# Altium schematic sheet Mixer.SchDoc: Ararinha 6F
size A4; Revision: 2.0; SheetNumber: 3; SheetTotal: 7
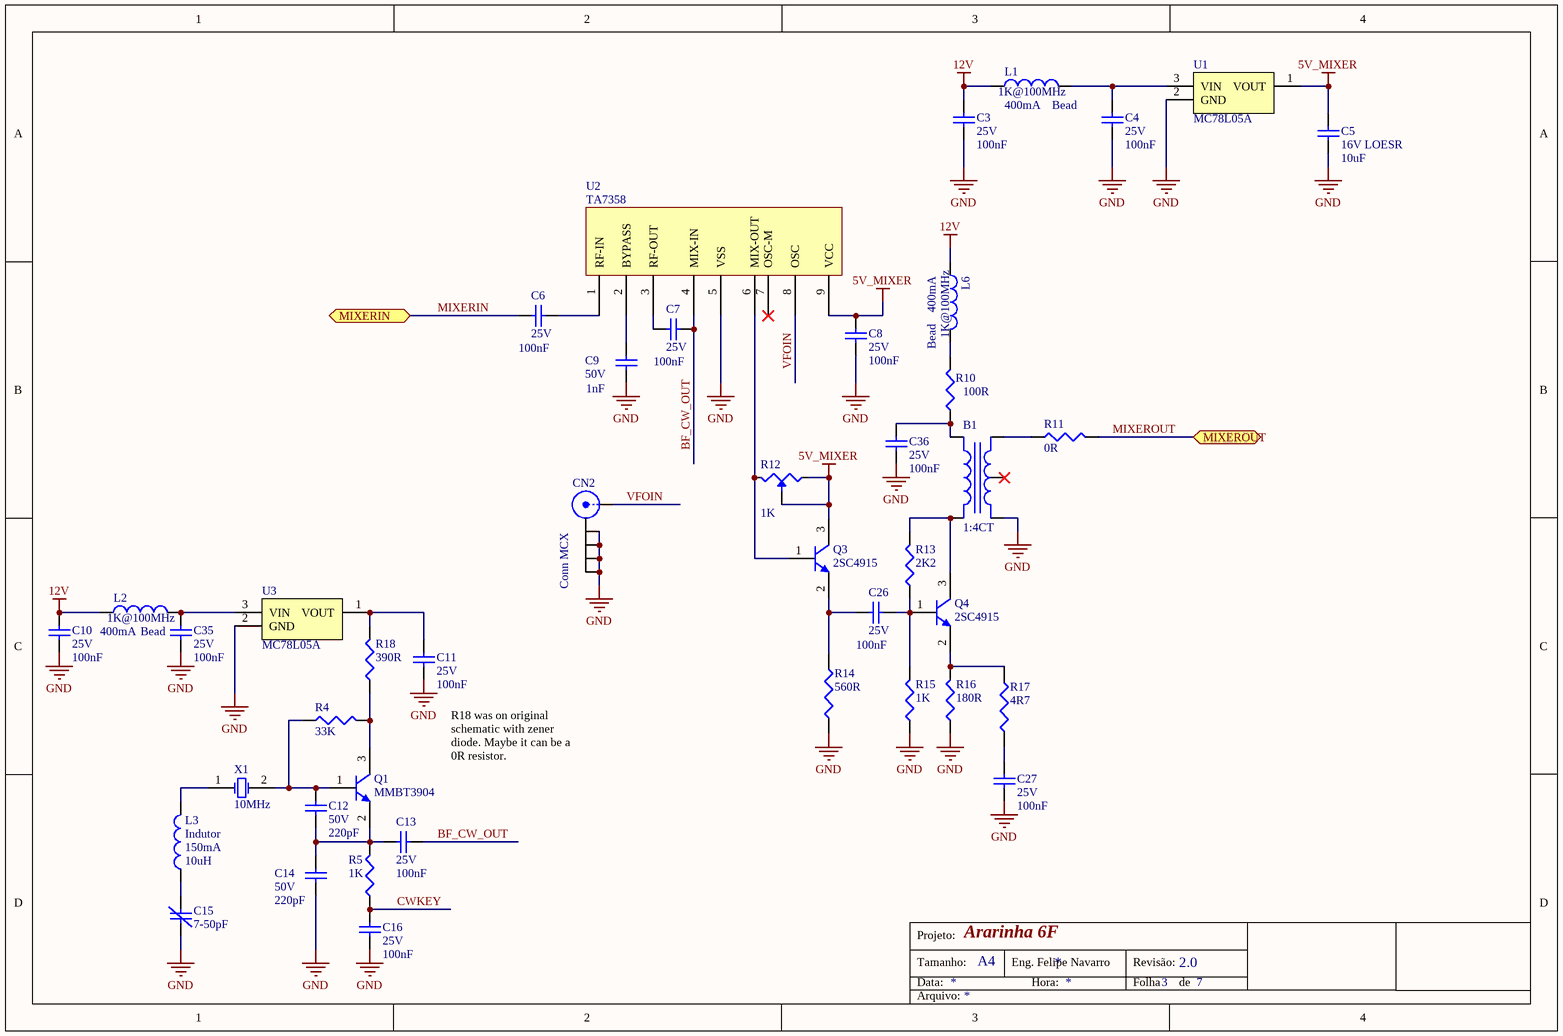
[diagram p0: Mixer.SchDoc]

## Parts
B1  1:4CT  [CX2047LANL]
C3  value 100nF  Tensão: 25V  [CC0603]  (hidden comment: Capacitor Cerâmico)
C4  value 100nF  Tensão: 25V  [CC0603]  (hidden comment: Capacitor Cerâmico)
C5  value 10uF  Tensão: 16V LOESR  [CC0805]  (hidden comment: Capacitor Cerâmico)
C6  value 100nF  Tensão: 25V  [CC0603]  (hidden comment: Capacitor Cerâmico)
C7  value 100nF  Tensão: 25V  [CC0603]  (hidden comment: Capacitor Cerâmico)
C8  value 100nF  Tensão: 25V  [CC0603]  (hidden comment: Capacitor Cerâmico)
C9  value 1nF  Tensão: 50V  [CC0603]  (hidden comment: Capacitor Cerâmico)
C10  value 100nF  Tensão: 25V  [CC0603]  (hidden comment: Capacitor Cerâmico)
C11  value 100nF  Tensão: 25V  [CC0603]  (hidden comment: Capacitor Cerâmico)
C12  value 220pF  Tensão: 50V  [CC0603]  (hidden comment: Capacitor Cerâmico)
C13  value 100nF  Tensão: 25V  [CC0603]  (hidden comment: Capacitor Cerâmico)
C14  value 220pF  Tensão: 50V  [CC0603]  (hidden comment: Capacitor Cerâmico)
C15  value 7-50pF  [MURATA TZB4]  (hidden comment: Trimmer)
C16  value 100nF  Tensão: 25V  [CC0603]  (hidden comment: Capacitor Cerâmico)
C26  value 100nF  Tensão: 25V  [CC0603]  (hidden comment: Capacitor Cerâmico)
C27  value 100nF  Tensão: 25V  [CC0603]  (hidden comment: Capacitor Cerâmico)
C35  value 100nF  Tensão: 25V  [CC0603]  (hidden comment: Capacitor Cerâmico)
C36  value 100nF  Tensão: 25V  [CC0603]  (hidden comment: Capacitor Cerâmico)
CN2  Conn MCX  [CONN MCX MOLEX]
L1  Bead  value 1K@100MHz  Corrente: 400mA  [CC0603]
L2  Bead  value 1K@100MHz  Corrente: 400mA  [CC0603]
L3  Indutor  value 10uH  Corrente: 150mA  [CC0805]
L6  Bead  value 1K@100MHz  Corrente: 400mA  [CC0603]
Q1  MMBT3904  [SOT-23-3N]
Q3  2SC4915  [SOT-23-3N]
Q4  2SC4915  [SOT-23-3N]
R4  value 33K  [CC0603]  (hidden comment: Resistor)
R5  value 1K  [CC0603]  (hidden comment: Resistor)
R10  value 100R  [CC0805]  (hidden comment: Resistor)
R11  value 0R  [CC0603~0805]  (hidden comment: Resistor)
R12  value 1K  [POT]  (hidden comment: Potenciômetro)
R13  value 2K2  [CC0603]  (hidden comment: Resistor)
R14  value 560R  [CC0603]  (hidden comment: Resistor)
R15  value 1K  [CC0603]  (hidden comment: Resistor)
R16  value 180R  [CC0603]  (hidden comment: Resistor)
R17  value 4R7  [CC0603]  (hidden comment: Resistor)
R18  value 390R  [CC0603]  (hidden comment: Resistor)
U1  MC78L05A  [SOT-89-3N]
U2  TA7358  [SIP9]
U3  MC78L05A  [SOT-89-3N]
X1  10MHz  [HC/49US]

## Ports
MIXERIN (bidir), MIXEROUT (bidir)

## Nets
5V_MIXER: C5.2 C8.1 Q3.3(C) R12.1 R12.2(TAP) U1.1(VOUT) U2.9(VCC)
12V: C3.1 C10.2 L1.1 L2.1 L6.1
GND: B1.3(Pri-) C3.2 C4.2 C5.1 C8.2 C9.2 C10.1 C11.1 C14.1 C15.1 C16.1 C27.2 C35.1 C36.2 CN2.2(Y) CN2.3(Y) CN2.4(Y) CN2.5(Y) R14.1 R15.1 R16.1 U1.2(GND) U2.5(VSS) U3.2(GND)
BF_CW_OUT: C7.1 C13.2 U2.4(MIX-IN)
CWKEY: C16.2 R5.1
MIXERIN: C6.2 ; port MIXERIN
MIXEROUT: R11.2 ; port MIXEROUT
VFOIN: CN2.1(X) U2.8(OSC)
NetB1_1: B1.1(Sec+) R11.1
NetB1_4: B1.4(Pri+) Q4.3(C) R13.2
NetB1_6: B1.6(Sec-) C36.1 R10.1
NetC4_1: C4.1 L1.2 U1.3(VIN)
NetC6_1: C6.1 U2.1(RF-IN)
NetC7_2: C7.2 U2.3(RF-OUT)
NetC9_1: C9.1 U2.2(BYPASS)
NetC11_2: C11.2 R18.2 U3.1(VOUT)
NetC12_1: C12.1 C13.1 C14.2 Q1.2(E) R5.2
NetC12_2: C12.2 Q1.1(B) R4.1 X1.2(OSC2)
NetC15_2: C15.2 L3.1
NetC26_1: C26.1 Q4.1(B) R13.1 R15.2
NetC26_2: C26.2 Q3.2(E) R14.2
NetC27_1: C27.1 R17.1
NetC35_2: C35.2 L2.2 U3.3(VIN)
NetL3_2: L3.2 X1.1(OSC1)
NetL6_2: L6.2 R10.2
NetQ1_3: Q1.3(C) R4.2 R18.1
NetQ3_1: Q3.1(B) R12.3 U2.6(MIX-OUT)
NetQ4_2: Q4.2(E) R16.2 R17.2

Not connected (* = marked no-connect by the designer): B1 2(Sec+)*; U2 7(OSC-M)*

## Notes on the sheet
- (near C11) R18 was on original schematic with zener diode. Maybe it can be a 0R resistor.
- Projeto:
- Tamanho:
- Data:
- A4
- Eng. Felipe Navarro
- Hora:
- Revisão:
- Folha
- de
- Arquivo:

## Library data of the parts
B1 = BALUN CX2047LANL: Balun 4CT:1; ChinesePrice: 0,00000; Chinês: ----; Corrente: *; Potência: *; Supplier 1: Digi-Key; Supplier Part Number 1: 553-2770-1-ND; Tensão: *; Obs:: *; Tolerância: *; ComponentLink1Description: Datasheet; ComponentLink1URL: D:\Tecnoclade\Datasheet\!DataMissing.pdf; Substituição: 00/00/0000; Value: *
C3 C4 C6-C8 C10 C11 C16 C26 C27 C35 C36 = Cap 100nF 25V 0603 X7R: Capacitor (Semiconductor SIM Model); Chinês: Local; ChinesePrice: 0,00246; Corrente: *A; Potência: *W; Obs:: X7R; Tolerância: ±10%; Supplier 1: Digi-Key; Supplier Part Number 1: 490-1524-1-ND; ComponentLink1Description: Datasheet; ComponentLink1URL: D:\Tecnoclade\Datasheet\!DataMissing.pdf
C5 = Cap 10uF 16V 0805 X6S LOESR: Capacitor (Semiconductor SIM Model); Chinês: -----; ChinesePrice: 0,00000; Corrente: *A; Potência: *W; Obs:: X6S - C2012X6S1C106K; Tolerância: ±10%; Supplier 1: Digi-Key; Supplier Part Number 1: 445-7611-1-ND; ComponentLink1Description: Datasheet; ComponentLink1URL: D:\Tecnoclade\Datasheet\!DataMissing.pdf
C9 = Cap 1nF 50V 0603 NP0: Capacitor (Semiconductor SIM Model); Chinês: Local; ChinesePrice: 0,00700; Corrente: *A; Potência: *W; Obs:: NP0; Tolerância: ±5%; Supplier 1: Digi-Key; Supplier Part Number 1: 490-1451-1-ND; ComponentLink1Description: Datasheet; ComponentLink1URL: D:\Tecnoclade\Datasheet\!DataMissing.pdf
C12 C14 = Cap 220pF 50V 0603 NP0: Capacitor (Semiconductor SIM Model); Chinês: -----; ChinesePrice: 0,00000; Corrente: *A; Potência: *W; Obs:: NP0; Tolerância: ±5%; Supplier 1: Digi-Key; Supplier Part Number 1: 1276-1048-1-ND; ComponentLink1Description: Datasheet; ComponentLink1URL: D:\Tecnoclade\Datasheet\!DataMissing.pdf
C13 = Cap 2.2pf 50V 0603 C0G: Capacitor (Semiconductor SIM Model); Chinês: ----; ChinesePrice: 0,00000; Corrente: *A; Potência: *W; Tolerância: ±*%; Supplier 1: Digi-Key; Supplier Part Number 1: 490-3091-1-ND; Obs:: *; ComponentLink1Description: Datasheet; ComponentLink1URL: D:\Tecnoclade\Datasheet\!DataMissing.pdf
C15 = Trimmer 7-50pF 50V TZB4-BB: Capacitor (Semiconductor SIM Model); Chinês: ----; ChinesePrice: 0,00000; Corrente: *A; Potência: *W; Tolerância: ±*%; Tensão: 50V; Supplier 1: Digi-Key; Supplier Part Number 1: 490-1983-1-ND; Obs:: *; ComponentLink1Description: Datasheet; ComponentLink1URL: D:\Tecnoclade\Datasheet\!DataMissing.pdf
CN2 = Conn MCX: Conector MCX; ChinesePrice: 0,00000; Chinês: ----; Value: SMA; Corrente: *; Potência: *; Supplier 1: Digi-Key; Supplier Part Number 1: WM5541-ND; Tensão: *; Obs:: *; Tolerância: *; ComponentLink1Description: Datasheet; ComponentLink1URL: D:\Tecnoclade\Datasheet\!DataMissing.pdf
L1 L2 L6 = Bd 1K@100MHz 0603 400mA: ChinesePrice: 0,00000; Chinês: -----; Obs:: Ferrite (0R5); Tolerância: ±25%; Potência: *; Supplier 1: Digi-Key; Supplier Part Number 1: 445-1550-1-ND; Tensão: *; ComponentLink1Description: Datasheet; ComponentLink1URL: D:\Tecnoclade\Datasheet\!DataMissing.pdf; Substituição: 27/06/2014
L3 = Ind 10uH 0805 150mA: Inductor; ChinesePrice: 0,00000; Chinês: ----; Tolerância: ±10%; Potência: *; Supplier 1: Digi-Key; Supplier Part Number 1: 587-2045-1-ND; Tensão: *; Obs:: *; ComponentLink1Description: Datasheet; ComponentLink1URL: D:\Tecnoclade\Datasheet\!DataMissing.pdf; Substituição: 00/00/0000
Q1 = TRS MMBT2222 40V 200mA SOT-23-3N: NPN General Purpose Amplifier; Tensão: 40V; Corrente: 200mA; Potência: 250mW; Chinês: ----; ChinesePrice: 0,00000; Value: 300MHz; Supplier 1: Digi-Key; Supplier Part Number 1: MMBT2222ATPMSCT-ND; Obs:: *; Tolerância: *; ComponentLink1Description: Datasheet; ComponentLink1URL: D:\Tecnoclade\Datasheet\!DataMissing.pdf
Q3 Q4 = TRS 2SC3324 120V 100mA SOT-23-3: NPN General Purpose Amplifier; Tensão: 40V; Corrente: 600mA; Potência: 350mW; Chinês: ----; ChinesePrice: 0,00000; Value: 300MHz; Supplier 1: Digi-Key; Supplier Part Number 1: 2SC4915-OLFCT-ND; Obs:: *; Tolerância: *; ComponentLink1Description: Datasheet; ComponentLink1URL: D:\Tecnoclade\Datasheet\!DataMissing.pdf
R4 = Res 33K 1% 0603 1/10W: ChinesePrice: 0,00000; Chinês: ----; Corrente: *A; Potência: 1/10W; Tensão: *V; Obs: ±100ppm/ºC; Tolerância: ±1%; Supplier 1: Digi-Key; Supplier Part Number 1: RMCF0603FT33K0CT-ND; ComponentLink1Description: Datasheet; ComponentLink1URL: D:\Tecnoclade\Datasheet\!DataMissing.pdf
R5 R15 = Res 1K 1% 0603 1/10W: ChinesePrice: 0,00089; Chinês: Local; Corrente: *A; Potência: 1/10W; Tensão: *V; Tolerância: ±1%; Supplier 1: Digi-Key; Supplier Part Number 1: RMCF0603FT1K00CT-ND; Obs: *; ComponentLink1Description: Datasheet; ComponentLink1URL: D:\Tecnoclade\Datasheet\!DataMissing.pdf
R10 = Res 100R 5% 0805 1/8W: ChinesePrice: 0,00150; Chinês: Local; Corrente: *A; Potência: 1/8W; Tensão: *V; Obs: ±200ppm/ºC; Tolerância: ±5%; Supplier 1: Digi-Key; Supplier Part Number 1: RMCF0805JT100RCT-ND; ComponentLink1Description: Datasheet; ComponentLink1URL: D:\Tecnoclade\Datasheet\!DataMissing.pdf
R11 = Res 0R 0603 1/10W: ChinesePrice: 0,00089; Chinês: Local; Corrente: *A; Potência: 1/10W; Tensão: *V; Tolerância: Jumper; Supplier 1: Digi-Key; Supplier Part Number 1: P0.0GCT-ND; Obs: *; ComponentLink1Description: Datasheet; ComponentLink1URL: D:\Tecnoclade\Datasheet\!DataMissing.pdf
R12 = Res Pot: Potenciometro; ChinesePrice: 0,00000; Chinês: ----; Corrente: *A; Potência: *W; Tensão: *V; Tolerância: ±*%; Supplier 1: Digi-Key; Supplier Part Number 1: --Del; Obs: *; ComponentLink1Description: Datasheet; ComponentLink1URL: D:\Tecnoclade\Datasheet\!DataMissing.pdf
R13 = Res 2K2 5% 0603 1/10W: ChinesePrice: 0,00000; Chinês: ----; Corrente: *A; Potência: 1/10W; Tensão: *V; Obs: ±200ºC/ppm; Tolerância: ±5%; Supplier 1: Digi-Key; Supplier Part Number 1: RMCF0603JT2K20CT-ND; ComponentLink1Description: Datasheet; ComponentLink1URL: D:\Tecnoclade\Datasheet\!DataMissing.pdf
R14 = Res 560R 1% 0603 1/10w: ChinesePrice: 0,00000; Chinês: ----; Corrente: *A; Potência: 1/10W; Tensão: *V; Tolerância: ±*%; Supplier 1: Digi-Key; Supplier Part Number 1: 311-560HRCT-ND; Obs:: *; ComponentLink1Description: Datasheet; ComponentLink1URL: D:\Tecnoclade\Datasheet\!DataMissing.pdf
R16 = Res 180R 1% 0603 1/10W: ChinesePrice: 0,00000; Chinês: -----; Corrente: *A; Potência: 1/10W; Tensão: *V; Obs: ±100ppm/ºC; Tolerância: ±1%; Supplier 1: Digi-Key; Supplier Part Number 1: RMCF0603FT180RCT-ND; ComponentLink1Description: Datasheet; ComponentLink1URL: D:\Tecnoclade\Datasheet\!DataMissing.pdf
R17 = Res 4R7 1% 0603 1/10W: ChinesePrice: 0,00000; Chinês: ----; Corrente: *A; Potência: 1/10W; Tensão: *V; Tolerância: ±*%; Supplier 1: Digi-Key; Supplier Part Number 1: 311-4.7GRCT-ND; Obs:: *; ComponentLink1Description: Datasheet; ComponentLink1URL: D:\Tecnoclade\Datasheet\!DataMissing.pdf
R18 = Res 390R 1% 0603 1/10W: ChinesePrice: 0,00000; Chinês: ----; Corrente: *A; Potência: 1/10W; Tensão: *V; Obs: ±100ppm/ºC; Tolerância: ±1%; Supplier 1: Digi-Key; Supplier Part Number 1: RMCF0603FT390RCT-ND; ComponentLink1Description: Datasheet; ComponentLink1URL: D:\Tecnoclade\Datasheet\!DataMissing.pdf
U1 U3 = MC78L05: Regulador Linear 5V; Chinês: -----; Corrente: 100mA; ChinesePrice: 0,00000; Potência: *; Value: *; Supplier 1: Digi-Key; Supplier Part Number 1: MC78L05ACHXCT-ND; Tensão: 5V; Obs:: *; Tolerância: *; ComponentLink1Description: Datasheet; ComponentLink1URL: D:\Tecnoclade\Datasheet\
U2 = TA7358: FM FRONT-END; ChinesePrice: 0,00000; Chinês: ----; Corrente: *; Potência: *; Tensão: *; Value: *; Supplier 1: Digi-Key; Obs:: *; Tolerância: *; ComponentLink1Description: Datasheet; ComponentLink1URL: D:\Tecnoclade\Datasheet\
X1 = XTAL: Crystal Oscillator; ChinesePrice: 0,00000; Chinês: ----; Value: 20pF/40R; Corrente: *; Potência: *; Supplier 1: Digi-Key; Supplier Part Number 1: --Del; Tensão: *; Obs:: *; Tolerância: *